# Altium schematic sheet Thermal.SchDoc
size A4; Organization: UltraZohm; SheetNumber: 34; SheetTotal: 40
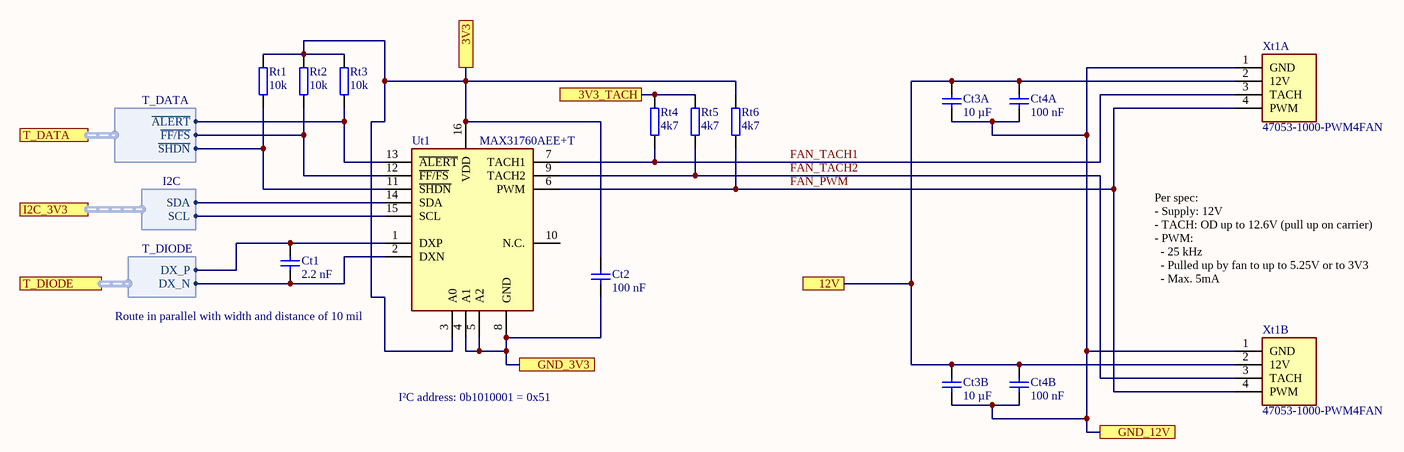
[diagram p0: Thermal.SchDoc]

## Parts
Ct1  2.2 nF  [C_0603_TE]
Ct2  100 nF  [C_0603_TE]
Ct3A  10 µF  [C_1206_TE]
Ct3B  10 µF  [C_1206_TE]
Ct4A  100 nF  [C_0603_TE]
Ct4B  100 nF  [C_0603_TE]
Rt1  10k  [R_0603_TE]
Rt2  10k  [R_0603_TE]
Rt3  10k  [R_0603_TE]
Rt4  4k7  [R_0603_TE]
Rt5  4k7  [R_0603_TE]
Rt6  4k7  [R_0603_TE]
Ut1  MAX31760AEE+T  [SOP64P602X175-16N]
Xt1A  47053-1000-PWM4FAN  [470531000]
Xt1B  47053-1000-PWM4FAN  [470531000]

## Ports
3V3, 3V3_TACH, 12V, GND_3V3, GND_12V, I2C_3V3 (harness I2C), T_DATA (harness T_DATA), T_DIODE (harness T_DIODE)

## Harnesses
I2C: SCL, SDA
T_DIODE: DX_P, DX_N
T_DATA: ~{ALERT}, ~{FF/FS}, ~{SHDN}

## Nets
3V3: Ct2.2 Rt1.2 Rt2.2 Rt3.2 Rt6.2 Ut1.3(A0) Ut1.16(VDD) ; port 3V3
3V3_TACH: Rt4.2 Rt5.2 ; port 3V3_TACH
12V: Ct3A.2 Ct3B.2 Ct4A.2 Ct4B.2 Xt1A.2(12V) Xt1B.2(12V) ; port 12V
FAN_PWM: Rt6.1 Ut1.6(PWM) Xt1A.4(PWM) Xt1B.4(PWM)
FAN_TACH1: Rt4.1 Ut1.7(TACH1) Xt1A.3(TACH)
FAN_TACH2: Rt5.1 Ut1.9(TACH2) Xt1B.3(TACH)
GND_3V3: Ct2.1 Ut1.4(A1) Ut1.5(A2) Ut1.8(GND) ; port GND_3V3
GND_12V: Ct3A.1 Ct3B.1 Ct4A.1 Ct4B.1 Xt1A.1(GND) Xt1B.1(GND) ; port GND_12V
NetCt1_1: Ct1.1 Ut1.2(DXN) ; port T_DIODE.DX_N
NetCt1_2: Ct1.2 Ut1.1(DXP) ; port T_DIODE.DX_P
NetRt1_1: Rt1.1 Ut1.11(~{SHDN}) ; port T_DATA.~{SHDN}
NetRt2_1: Rt2.1 Ut1.12(~{FF/FS}) ; port T_DATA.~{FF/FS}
NetRt3_1: Rt3.1 Ut1.13(~{ALERT}) ; port T_DATA.~{ALERT}
NetUt1_14: Ut1.14(SDA) ; port I2C_3V3.SDA
NetUt1_15: Ut1.15(SCL) ; port I2C_3V3.SCL

Not connected (* = marked no-connect by the designer): Ut1 10(N.C.)

## Notes on the sheet
- (near Ut1) Route in parallel with width and distance of 10 mil
- Per spec:
  - Supply: 12V
  - TACH: OD up to 12.6V (pull up on carrier)
  - PWM:
  - 25 kHz
  - Pulled up by fan to up to 5.25V or to 3V3
  - Max. 5mA
- I²C address: 0b1010001 = 0x51
- Title
- Revision:
- Design Engineer:
- Date:
- Project:
- Sheet
- of

## Library data of the parts
Ct1 = UZgen_C_0603_2.2nF_50V_X7R: Generic capacitor; Manufacturer: UZgen; Voltage: 50V; Tolerance: 10 %; Created from: UZgenTool; Manufacturer Part Number: UZgen_C_0603_2.2nF_50V_X7R; PartID: 4247; Created On: 02/08/2024 11:18:09; Value: 2.2 nF; Device Package: 0603; Technology: X7R; Mounting Type: SMD; Last Updated: 02/08/2024 11:18:09
Ct2 Ct4A Ct4B = UZgen_C_0603_100nF_50V_X7R: Generic capacitor; Manufacturer: UZgen; Voltage: 50V; Tolerance: 10 %; Created from: AGeiger; Manufacturer Part Number: UZgen_C_0603_100nF_50V_X7R; PartID: 1; Created On: 02/07/2024 14:42:23; Value: 100 nF; Device Package: 0603; Technology: X7R; Mounting Type: SMD; Last Updated: 08/08/2024 15:01:15
Ct3A Ct3B = UZgen_C_1206_10uF_50V_X7R: Generic capacitor; Manufacturer: UZgen; Tolerance: 10 %; Created from: MGeier; Voltage: 50V; Manufacturer Part Number: UZgen_C_1206_10uF_50V_X7R; PartID: 5807; Created On: 20/03/2025 14:05:00; Device Package: 1206; Last Updated: 20/03/2025 14:05:00; Mounting Type: SMD; Value: 10 µF; Technology: X7R
Rt1-Rt3 = UZgen_R_0603_10k: Generic resistor; Manufacturer: UZgen; Tolerance: 1 %; Created from: AGeiger; Manufacturer Part Number: UZgen_R_0603_10k; PartID: 1; Created On: 02/07/2024 14:34:53; Value: 10k; Device Package: 0603; Mounting Type: SMD; Last Updated: 02/07/2024 14:37:16
Rt4-Rt6 = UZgen_R_0603_4k7: Generic resistor; Manufacturer: UZgen; Tolerance: 1 %; Created from: UZgenTool; Manufacturer Part Number: UZgen_R_0603_4k7; PartID: 237; Created On: 02/07/2024 17:29:50; Value: 4k7; Device Package: 0603; Mounting Type: SMD; Last Updated: 02/07/2024 17:29:50
Ut1 = MAX31760AEE+T: Motor/Motion/Ignition Controllers & Drivers Fan Speed Controller with LUT t&r; Manufacturer: Analog Devices Inc.; Created from: FRosner; Manufacturer Part Number: MAX31760AEE+T; PartID: 18; Created On: 02/07/2024 15:15:09; ComponentLink1Description: Datasheet; ComponentLink1URL: https://www.analog.com/media/en/technical-documentation/data-sheets/MAX31760.pdf; Component Type: Fan Controller; Device Package: QSOP-16; Last Updated: 04/09/2024 11:48:15; Mounting Type: SMD/SMT; Operating Temperature: -40 - 125 °C; Series: MAX31760; Supplier 1: Mouser; Supplier Part Number 1: 700-MAX31760AEE+T; Supplier 2: LCSC; Supplier Part Number 2: C3031567; Type: Driver; Live Cycle Status: 1; LCSC Part Number: C3031567; Stock number: not stored
Xt1A Xt1B = 47053-1000-PWM4FAN: Headers & Wire Housings 4P VERT HDR W/FL; Manufacturer_Name: Molex; Created from: FRosner; Number of positions: 4; Datasheet Link: http://www.molex.com/pdm_docs/sd/470531000_sd.pdf; Height: 8mm; Manufacturer_Part_Number: 47053-1000; Mouser Part Number: 538-47053-1000; Mouser Price/Stock: https://www.mouser.co.uk/ProductDetail/Molex/47053-1000?qs=ph4zPCVRuvqoDX7hrEhxNA%3D%3D; Manufacturer Part Number: 47053-1000-PWM4FAN; PartID: 17; Created On: 21/08/2024 08:09:57; ComponentLink1Description: Datasheet; ComponentLink1URL: https://tools.molex.com/pdm_docs/sd/470531000_sd.pdf; Component Type: Pin Header; Device Package: THT; Last Updated: 04/09/2024 14:33:45; Manufacturer: Molex; Mounting Type: THT; Series: 47053; Supplier 1: Mouser; Supplier Part Number 1: 538-47053-1000; Supplier 2: LCSC; Supplier Part Number 2: C240840; Type: Pin Header; Live Cycle Status: 1; LCSC Part Number: C240840; Stock number: not stored; Number of rows: 1